# Altium schematic sheet chess.SchDoc
size A4; SheetNumber: 1; SheetTotal: 1
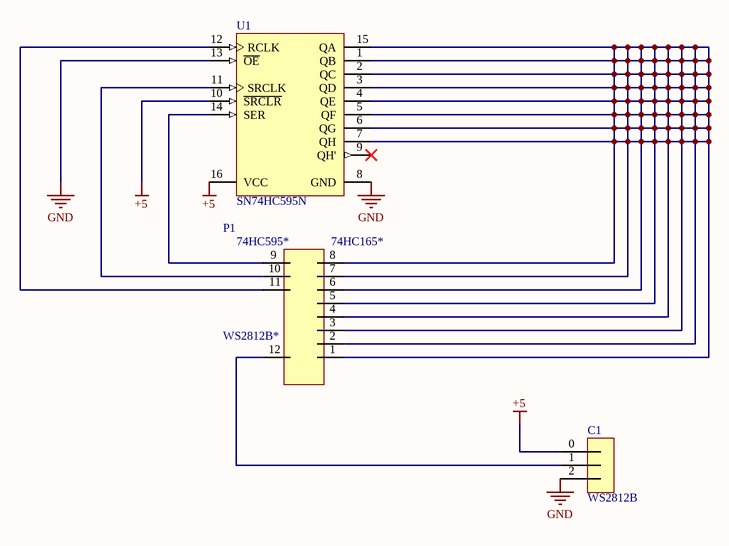
[diagram p0: chess.SchDoc]

## Parts
C1  WS2812B
P1  Connector  (value not drawn)
U1  SN74HC595N  [N0016A]

## Nets
+5: C1.0 U1.10(~{SRCLR}) U1.16(VCC)
GND: C1.2 U1.8(GND) U1.13(~{OE})
NetC1_1: C1.1 P1.12
NetP1_1: P1.1 P1.2 P1.3 P1.4 P1.5 P1.6 P1.7 P1.8 U1.1(QB) U1.2(QC) U1.3(QD) U1.4(QE) U1.5(QF) U1.6(QG) U1.7(QH) U1.15(QA)
NetP1_9: P1.9 U1.14(SER)
NetP1_10: P1.10 U1.11(SRCLK)
NetP1_11: P1.11 U1.12(RCLK)

Not connected (* = marked no-connect by the designer): U1 9(QH')*

## Notes on the sheet
- (in symbol Connector) 74HC595*; 74HC165*; WS2812B*

## Library data of the parts
P1 = Connector: Placeholder for arduino / GPIO pins
U1 = CMP-0780-00137-3: 8-Bit Shift Registers With 3-State Output Registers, N0016A, TUBE; Manufacturer: Texas Instruments; F @ Nom Voltage(Max)(Mhz): 28; Input Type: CMOS; Bits: 8; VCC(Min)(V): 2; 3-State Output: Yes; ICC @ Nom Voltage(Max)(mA): 0.08; VCC(Max)(V): 6; tpd @ Nom Voltage(Max)(ns): 34; Rating: Military; Technology Family: HC; Output Drive (IOL/IOH)(Max)(mA): 7.8/-7.8; Code_JEDEC: MS-001; Output Type: CMOS; Operating Temperature Range(C): -40 to 85; Voltage(Nom)(V): 6; Generic Part Number: SN74HC595; DatasheetVersion: SCLS041H; PackageReference: N0016A; PackageVersion: http://www.ti.com/lit/ml/mpdi002c/mpdi002c.pdf